# EAGLE design smartcar_shield_cutouts (EAGLE 9.4.0)
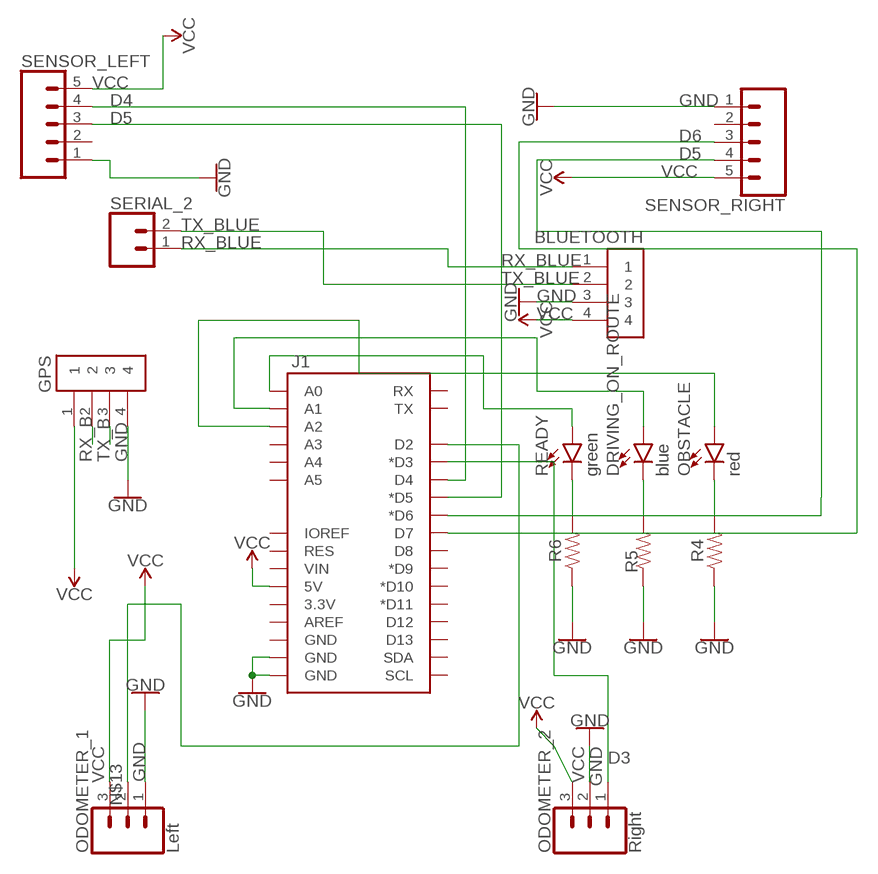
[diagram p0: schematic, sheet 1]

## Parts
BLUETOOTH  1X4-BIG  [1X04-BIG]
DRIVING_ON_ROUTE  blue  LED5MM  [LED_5MM]
GPS  1X4-BIG  [1X04-BIG]
J1  ARDUINO_R3_SHIELDUNO_R3_SHIELD_LOCK  [UNO_R3_SHIELD_LOCK]
OBSTACLE  red  LED5MM  [LED_5MM]
ODOMETER_1  Left  CONN_03  [1X03]
ODOMETER_2  Right  CONN_03  [1X03]
R4  RESISTORAXIAL-0.3  [AXIAL-0.3]
R5  RESISTORAXIAL-0.3  [AXIAL-0.3]
R6  RESISTORAXIAL-0.3  [AXIAL-0.3]
READY  green  LED5MM  [LED_5MM]
SENSOR_LEFT  CONN_05  [1X05]
SENSOR_RIGHT  CONN_05  [1X05]
SERIAL_2  CONN_02  [1X02]

## Nets
D3: J1.D3(*D3) ODOMETER_2.1
D4: J1.D4 SENSOR_LEFT.4
D5: J1.D5(*D5) J1.D6(*D6) SENSOR_LEFT.3 SENSOR_RIGHT.4
D6: J1.D7 SENSOR_RIGHT.3
GND: BLUETOOTH.3 GPS.4 J1.GND@0(GND) J1.GND@1(GND) ODOMETER_1.1 ODOMETER_2.2 R4.P$1 R5.P$1 R6.P$1 SENSOR_LEFT.1 SENSOR_RIGHT.1
N$2: R6.P$2 READY.K(C)
N$9: DRIVING_ON_ROUTE.K(C) R5.P$2
N$11: OBSTACLE.K(C) R4.P$2
N$12: DRIVING_ON_ROUTE.A J1.A1
N$13: J1.D2 ODOMETER_1.2
N$14: J1.A2 OBSTACLE.A
N$15: J1.A0 READY.A
RX_B: GPS.2
RX_BLUE: BLUETOOTH.1 SERIAL_2.1
TX_B: GPS.3
TX_BLUE: BLUETOOTH.2 SERIAL_2.2
VCC: BLUETOOTH.4 GPS.1 J1.5V ODOMETER_1.3 ODOMETER_2.3 SENSOR_LEFT.5 SENSOR_RIGHT.5
Unconnected: J1.3.3V J1.A3 J1.A4 J1.A5 J1.AREF J1.D8 J1.D9(*D9) J1.D10(*D10) J1.D11(*D11) J1.D12 J1.D13 J1.GND@2(GND) J1.IOREF J1.RES J1.RX J1.SCL J1.SDA J1.TX J1.VIN SENSOR_LEFT.2 SENSOR_RIGHT.2

## Library data of the parts
BLUETOOTH GPS = adafruit:1X4: 4-pin connector
DRIVING_ON_ROUTE OBSTACLE READY = SparkFun-LED:LED: LED (Generic) Standard schematic elements and footprints for 5mm, 3mm, 1206, and 0603 sized LEDs. Generic LEDs with no color specified.
J1 = SparkFun-Boards:ARDUINO_R3_SHIELD: Shield form compatible with the Arduino Uno R3.
ODOMETER_1 ODOMETER_2 = SparkFun-Connectors:CONN_03: Multi connection point. Often used as Generic Header-pin footprint for 0.1 inch spaced/style header connections On any of the 0.1 inch spaced packages, you can populate with these: Break Away Headers - Straight <https://www.sparkfun.com/products/116> (PRT-00116) Break Away Male Headers - Right Angle <https://www.sparkfun.com/products/553> (PRT-00553) Female Headers <https://www.sparkfun.com/products/115> (PRT-00115) Break Away Headers - Machine Pin <https://www.sparkfun.com/products/117> (PRT-00117) Break Away Female Headers - Swiss Machine Pin <https://www.sparkfun.com/products/743> (PRT-00743) Stackable Header - 3 Pin (Female, 0.1") <https://www.sparkfun.com/products/13875> (PRT-13875) For SCREWTERMINALS and SPRING TERMINALS visit here: Screw Terimnals on SparkFun.com <https://www.sparkfun.com/search/results?term=Screw+Terminals> (5mm/3.5mm/2.54mm spacing) This device is also useful as a general connection point to wire up your design to another part of your project. Our various solder wires solder well into these plated through hole pads. Hook-Up Wire - Assortment (Stranded, 22 AWG) <https://www.sparkfun.com/products/11375> (PRT-11375) Hook-Up Wire - Assortment (Solid Core, 22 AWG) <https://www.sparkfun.com/products/11367> (PRT-11367) View the entire wire category on our website here <https://www.sparkfun.com/categories/141> Special notes: Molex polarized connector foot print use with SKU : PRT-08232 with associated crimp pins and housings.; PROD_ID: XXX-00000; VALUE: 455-1750-1-ND
R4-R6 = SparkFun-Resistors:RESISTOR: Generic Resistor Package
SENSOR_LEFT SENSOR_RIGHT = SparkFun-Connectors:CONN_05: Multi connection point. Often used as Generic Header-pin footprint for 0.1 inch spaced/style header connections On any of the 0.1 inch spaced packages, you can populate with these: Break Away Headers - Straight <https://www.sparkfun.com/products/116> (PRT-00116) Break Away Male Headers - Right Angle <https://www.sparkfun.com/products/553> (PRT-00553) Female Headers <https://www.sparkfun.com/products/115> (PRT-00115) Break Away Headers - Machine Pin <https://www.sparkfun.com/products/117> (PRT-00117) Break Away Female Headers - Swiss Machine Pin <https://www.sparkfun.com/products/743> (PRT-00743) For SCREWTERMINALS and SPRING TERMINALS visit here: Screw Terimnals on SparkFun.com <https://www.sparkfun.com/search/results?term=Screw+Terminals> (5mm/3.5mm/2.54mm spacing) This device is also useful as a general connection point to wire up your design to another part of your project. Our various solder wires solder well into these plated through hole pads. Hook-Up Wire - Assortment (Stranded, 22 AWG) <https://www.sparkfun.com/products/11375> (PRT-11375) Hook-Up Wire - Assortment (Solid Core, 22 AWG) <https://www.sparkfun.com/products/11367> (PRT-11367) View the entire wire category on our website here <https://www.sparkfun.com/categories/141> Special notes: Molex polarized connector foot print use with SKU : PRT-08231 with associated crimp pins and housings. 1MM SMD Version SKU: PRT-10208
SERIAL_2 = SparkFun-Connectors:CONN_02: Multi connection point. Often used as Generic Header-pin footprint for 0.1 inch spaced/style header connections On any of the 0.1 inch spaced packages, you can populate with these: Break Away Headers - Straight <https://www.sparkfun.com/products/116> (PRT-00116) Break Away Male Headers - Right Angle <https://www.sparkfun.com/products/553> (PRT-00553) Female Headers <https://www.sparkfun.com/products/115> (PRT-00115) Break Away Headers - Machine Pin <https://www.sparkfun.com/products/117> (PRT-00117) Break Away Female Headers - Swiss Machine Pin <https://www.sparkfun.com/products/743> (PRT-00743) For SCREWTERMINALS and SPRING TERMINALS visit here: Screw Terimnals on SparkFun.com <https://www.sparkfun.com/search/results?term=Screw+Terminals> (5mm/3.5mm/2.54mm spacing) This device is also useful as a general connection point to wire up your design to another part of your project. Our various solder wires solder well into these plated through hole pads. Hook-Up Wire - Assortment (Stranded, 22 AWG) <https://www.sparkfun.com/products/11375> (PRT-11375) Hook-Up Wire - Assortment (Solid Core, 22 AWG) <https://www.sparkfun.com/products/11367> (PRT-11367) View the entire wire category on our website here <https://www.sparkfun.com/categories/141> Special notes: Molex polarized connector foot print use with: PRT-08233 with associated crimp pins and housings. 2.54_SCREWTERM for use with PRT-10571. 3.5mm Screw Terminal footprints for PRT-08084 5mm Screw Terminal footprints for use with PRT-08432

## Net classes
0 default: width 0.152 mm, drill 0.305 mm, clearance 0.152 mm

## Board
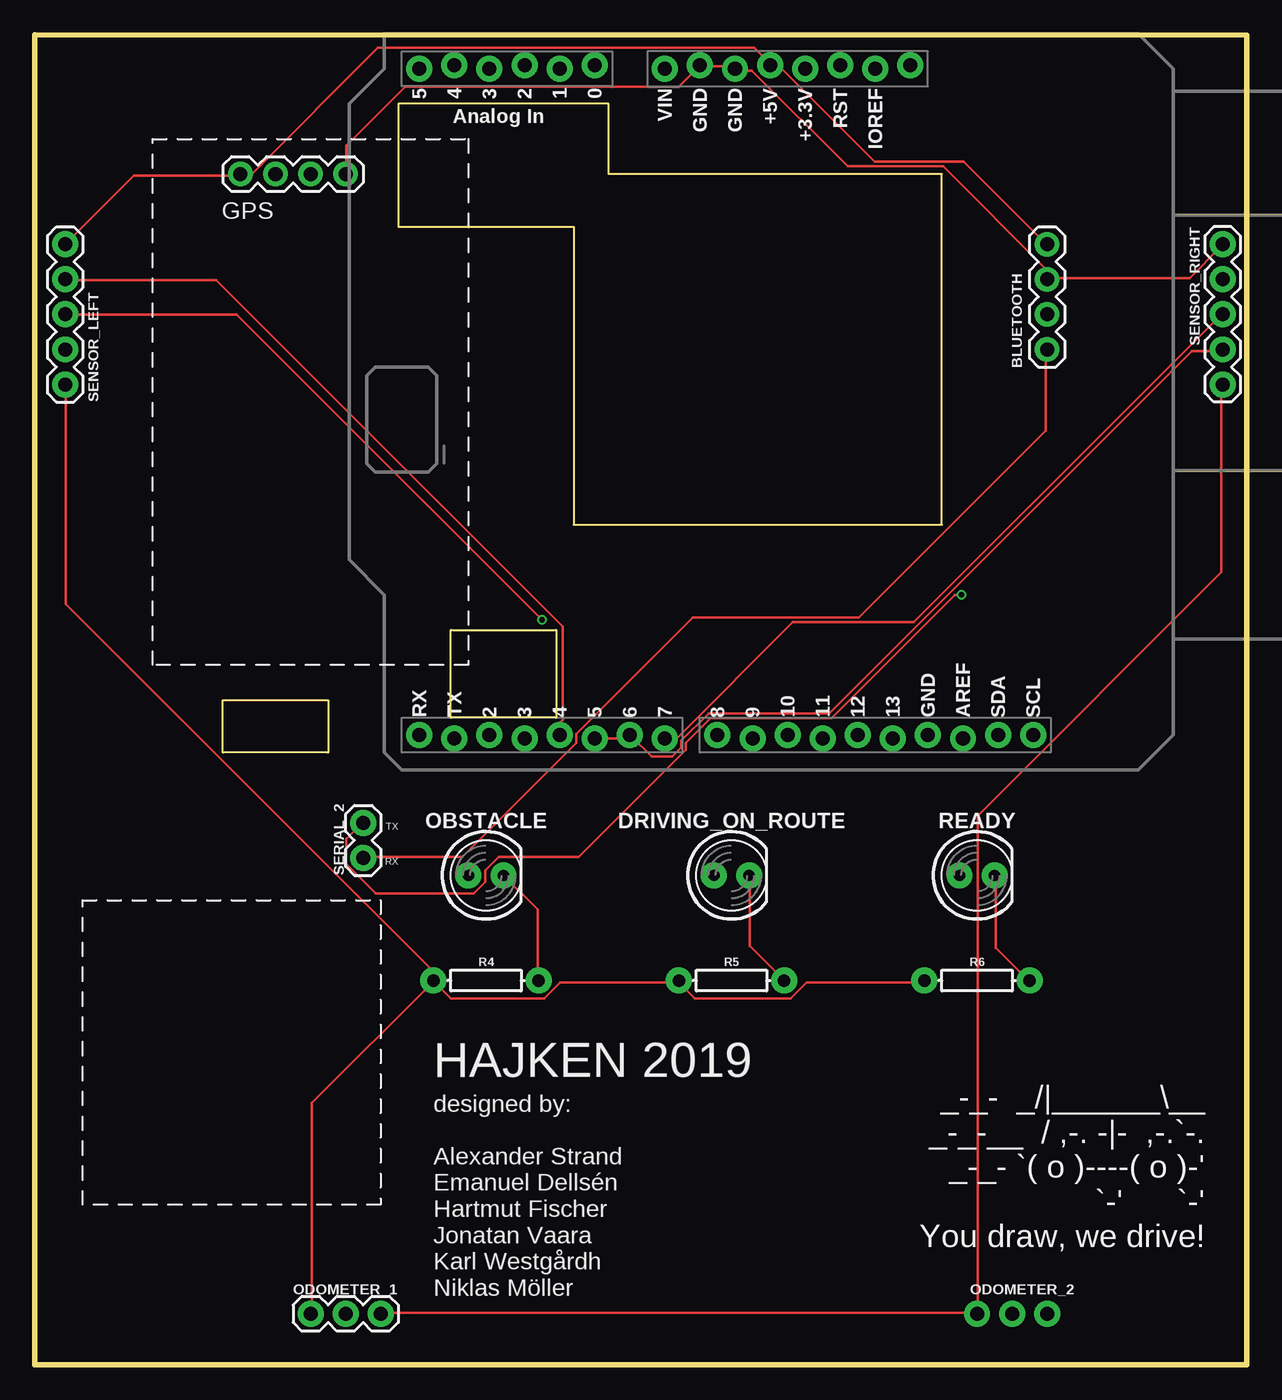
[diagram p1: board, top side]
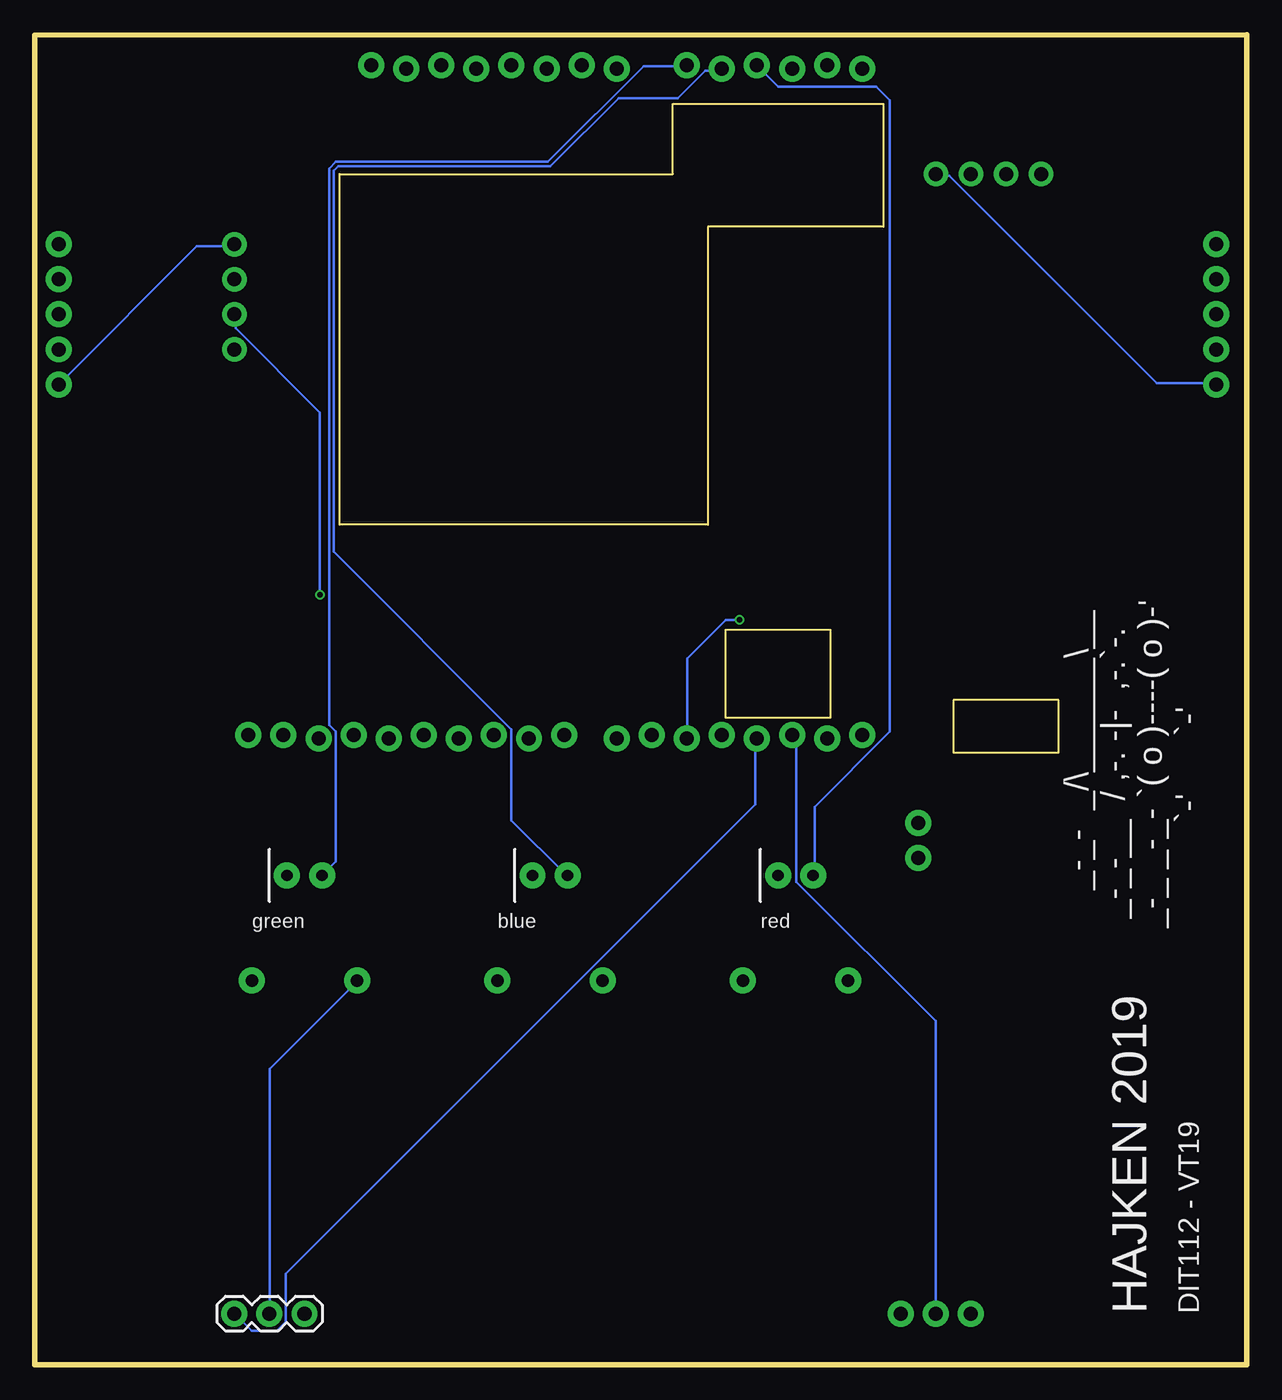
[diagram p2: board, bottom side, seen from below]

Size 87.8 x 96.38 mm. Coordinates in mm from the lower left corner, seen from the top.
Outline: 87.8,0 0,0 0,96.38 87.8,96.33 87.8,0
Outline: 65.71,60.87 65.71,86.27 41.58,86.27 41.58,91.35 26.34,91.35 26.34,82.46 39.04,82.46 39.04,60.87 65.71,60.87
Outline: 30.15,53.25 37.77,53.25 37.77,46.9 30.15,46.9 30.15,53.25
Outline: 13.64,48.17 21.26,48.17 21.26,44.36 13.64,44.36 13.64,48.17
Copper layers (1*16): Top 0.035mm / dielectric 1.5mm / Bottom 0.035mm
Design rules "SeeedStudio_2layer_DRU_edited": minimum track width 7mil, minimum drill 15mil, track to track 6mil, track to pad 6mil, pad to pad 6mil, via to via 6mil, smd to smd 0mil, copper to edge 10mil, drill to drill 10mil, minimum pad ring 10mil, minimum via ring 6mil, stop-mask expansion 2mil, vias tented up to drill 100mil, thermal gap 10mil

### Footprints (pad centres in the part's own frame; a part is rotated, then mirrored left to right if it is on the bottom)
1X04-BIG = drill 1.016 pad 1.778: 1 0,0; 2 2.54,0; 3 5.08,0; 4 7.62,0
LED_5MM = drill 0.813 pad 1.88: A -1.27,0; K 1.27,0
UNO_R3_SHIELD_LOCK = drill 1.016 pad 1.88: 3.3V 50.8,26.67; 5V 51.054,29.21; A0 51.054,41.91; A1 50.8,44.45; A2 51.054,46.99; A3 50.8,49.53; A4 51.054,52.07; A5 50.8,54.61; AREF 2.286,15.24; D2 2.54,49.53; D3 2.286,46.99; D4 2.54,44.45; D5 2.286,41.91; D6 2.54,39.37; D7 2.286,36.83; D8 2.54,33.02; D9 2.286,30.48; D10 2.54,27.94; D11 2.286,25.4; D12 2.54,22.86; D13 2.286,20.32; GND@0 50.8,31.75; GND@1 51.054,34.29; GND@2 2.54,17.78; IOREF 50.8,21.59; NC 51.054,19.05; RES 51.054,24.13; RX 2.54,54.61; SCL 2.54,10.16; SDA 2.54,12.7; TX 2.286,52.07; VIN 50.8,36.83
1X03 = drill 1.016 pad 1.88: 1 0,0; 2 2.54,0; 3 5.08,0
AXIAL-0.3 = drill 0.9 pad 1.88: P$1 -3.81,0; P$2 3.81,0
1X05 = drill 1.016 pad 1.88: 1 0,0; 2 2.54,0; 3 5.08,0; 4 7.62,0; 5 10.16,0
1X02 = drill 1.016 pad 1.88: 1 0,0; 2 2.54,0

### Placement (x,y rotation side)
BLUETOOTH  73.33,73.57 90 top
DRIVING_ON_ROUTE  50.47,35.47 0 top
GPS  14.91,86.27 0 top
J1  82.47,43.09 90 top
OBSTACLE  32.69,35.47 0 top
ODOMETER_1  19.99,3.72 0 top
ODOMETER_2  73.33,3.72 0 bottom
R4  32.69,27.85 0 top
R5  50.47,27.85 0 top
R6  68.25,27.85 0 top
READY  68.25,35.47 0 top
SENSOR_LEFT  2.21,71.03 90 top
SENSOR_RIGHT  86.03,81.19 270 top
SERIAL_2  23.8,36.74 90 top

### Tracks (layer width: path | path; a pad name or v marks a point on that pad's centre or on a via)
D3
  Bottom 0.178: J1.D3 35.6,45.22 35.6,40.6 69.61,6.59 69.61,3.12 70.27,2.46 72.08,2.46 73.24,3.62 ODOMETER_2.1
D4
  Top 0.178: J1.D4 38.07,45.72 38.07,46.54 38.24,46.71 38.24,53.48 13.14,78.57 2.25,78.57 SENSOR_LEFT.4
D5  (via drill 0.38)
  Top 0.178: J1.D5 40.72,45.39 42.86,45.39 J1.D6 43.19,45.55 44.68,44.07 46.16,44.07 46.82,44.73 46.82,45.22 48.81,47.2 57.56,47.2 83.81,73.46 85.95,73.46 SENSOR_RIGHT.4 | v36.75,53.97 14.63,76.1 2.25,76.1 SENSOR_LEFT.3
  Bottom 0.178: v36.75,53.97 37.74,53.97 40.55,51.17 J1.D5
D6
  Top 0.178: J1.D7 45.67,45.39 46.49,45.39 54.91,53.81 63.66,53.81 85.95,76.1 SENSOR_RIGHT.3
GND
  Top 0.178: ODOMETER_1.1 20.08,3.78 20.08,18.97 28.83,27.72 R4.P$1 | 46.66,27.72 38.07,27.72 36.92,26.57 30.15,26.57 28.99,27.72 R4.P$1 | 46.66,27.72 47.82,26.57 54.75,26.57 55.91,27.72 64.33,27.72 R6.P$1 | 46.66,27.72 R5.P$1 | SENSOR_RIGHT.1 85.95,81.05 83.64,78.74 73.41,78.74 BLUETOOTH.3 73.24,78.74 73.24,79.4 65.81,86.83 58.88,86.83 51.94,93.76 50.79,93.76 J1.GND@0 50.62,93.93 50.46,94.09 48.31,94.09 J1.GND@1 48.15,94.09 46.66,92.61 26.85,92.61 22.55,88.31 22.55,86.33 GPS.4 | R4.P$1 28.83,27.89 28.83,28.55 2.25,55.13 2.25,70.98 SENSOR_LEFT.1
  Bottom 0.178: ODOMETER_2.2 70.77,3.78 70.77,21.45 64.49,27.72 R6.P$1 | GPS.4 22.39,86.17 21.56,86.17 6.54,71.14 2.25,71.14 SENSOR_LEFT.1
N$2
  Top 0.178: READY.K 69.61,35.32 69.61,30.2 71.92,27.89 R6.P$2
N$9
  Top 0.178: DRIVING_ON_ROUTE.K 51.78,35.32 51.78,30.36 54.25,27.89 R5.P$2
N$11
  Top 0.178: OBSTACLE.K 36.42,33.01 36.42,27.89 R4.P$2
N$12
  Bottom 0.178: J1.A1 38.07,93.76 39.23,93.76 41.21,91.78 45.5,91.78 50.46,86.83 65.81,86.83 66.14,86.5 66.14,58.93 53.26,46.05 53.26,39.45 49.3,35.48 DRIVING_ON_ROUTE.A
N$13
  Bottom 0.178: ODOMETER_1.2 22.55,3.78 22.55,24.92 32.63,34.99 32.63,45.39 32.79,45.55 J1.D2
N$14
  Bottom 0.178: J1.A2 33.95,92.61 26.85,92.61 25.86,91.62 25.86,45.88 31.31,40.44 31.31,35.48 OBSTACLE.A
N$15
  Bottom 0.178: READY.A 65.98,36.47 65.98,45.88 66.47,46.38 66.47,86.66 65.98,87.16 50.62,87.16 43.69,94.09 40.72,94.09 J1.A0
RX_BLUE
  Top 0.178: BLUETOOTH.1 73.24,73.46 73.24,67.68 59.7,54.14 47.65,54.14 39.23,45.72 39.23,45.06 30.98,36.8 23.88,36.8 SERIAL_2.1
TX_BLUE  (via drill 0.38)
  Top 0.178: v67.13,55.79 66.64,55.79 57.72,46.88 48.97,46.88 47.15,45.06 47.15,44.56 39.4,36.8 33.62,36.8 32.63,35.81 32.63,34.99 31.8,34.16 24.7,34.16 22.55,36.31 22.55,38.12 23.71,39.28 SERIAL_2.2
  Bottom 0.178: v67.13,55.79 67.13,69 73.24,75.11 73.24,76.1 BLUETOOTH.2
VCC
  Top 0.178: ODOMETER_1.3 25.2,3.78 68.12,3.78 ODOMETER_2.3 68.29,3.78 68.29,39.77 85.95,57.44 85.95,70.98 SENSOR_RIGHT.5 | SENSOR_LEFT.5 2.25,81.22 7.2,86.17 14.8,86.17 GPS.1 14.96,86.33 15.79,86.33 24.87,95.41 52.11,95.41 53.26,94.26 J1.5V 53.26,94.09 53.92,94.09 60.86,87.16 67.3,87.16 73.24,81.22 BLUETOOTH.4
  Bottom 0.178: BLUETOOTH.4 73.41,81.05 76.05,81.05 85.95,71.14 SENSOR_RIGHT.5

### Text on the board
tNames: TX | RX | _-_- _/|______\\__ / _-_-__ / ,-. -|- ,-.`-. / _-_- `( o )----( o )-' / `-' `-' / You draw, we drive! | HAJKEN 2019 | designed by: / / Alexander Strand / Emanuel Dellsén / Hartmut Fischer / Jonatan Vaara / Karl Westgårdh / Niklas Möller
bNames: _-_- _/\______\\__ / _-_-__ / ,-. -|- ,-.`-. / _-_ _-_- `( o )----( o )-' / `-' `-' | red | blue | green | DIT112 - VT19 | HAJKEN 2019